# Altium project Scaffold.PrjPcb (part 2 of 2)

## Sheet Connectors.SchDoc
size A3; SheetNumber: 4; SheetTotal: 7
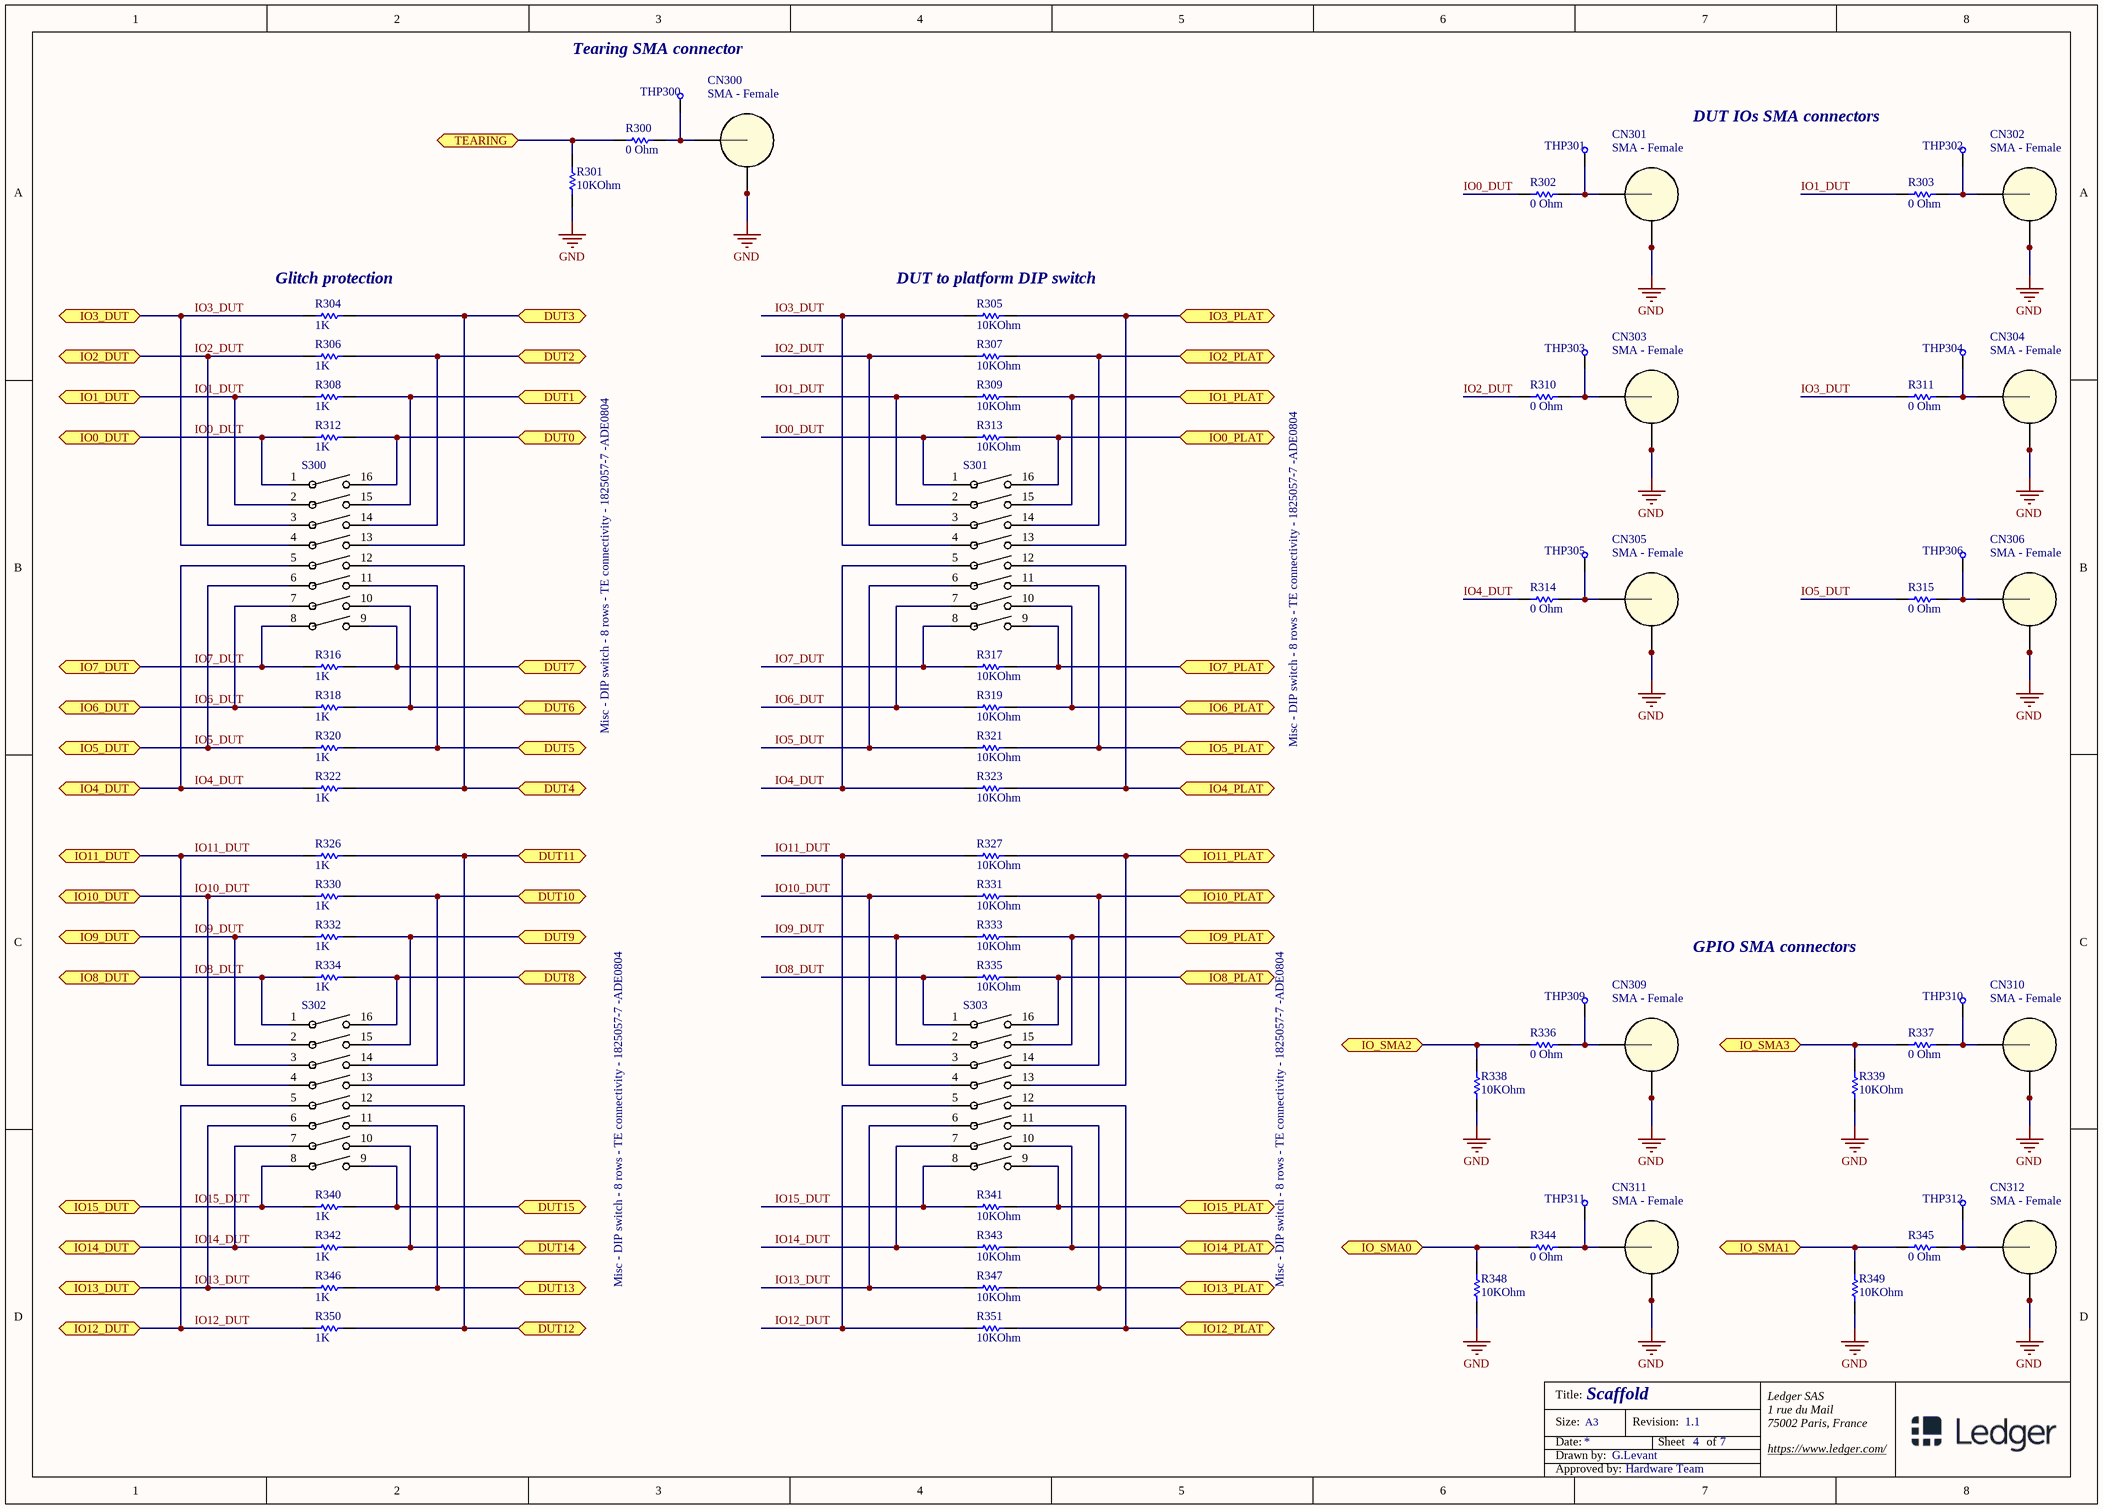
[diagram p5: Connectors.SchDoc]

### Parts
CN300  SMA - Female  [SAMTEC_SMA-J-P-X-ST-EM3]
CN301  SMA - Female  [SAMTEC_SMA-J-P-X-ST-EM3]
CN302  SMA - Female  [SAMTEC_SMA-J-P-X-ST-EM3]
CN303  SMA - Female  [SAMTEC_SMA-J-P-X-ST-EM3]
CN304  SMA - Female  [SAMTEC_SMA-J-P-X-ST-EM3]
CN305  SMA - Female  [SAMTEC_SMA-J-P-X-ST-EM3]
CN306  SMA - Female  [SAMTEC_SMA-J-P-X-ST-EM3]
CN309  SMA - Female  [SAMTEC_SMA-J-P-X-ST-EM3]
CN310  SMA - Female  [SAMTEC_SMA-J-P-X-ST-EM3]
CN311  SMA - Female  [SAMTEC_SMA-J-P-X-ST-EM3]
CN312  SMA - Female  [SAMTEC_SMA-J-P-X-ST-EM3]
R300  0 Ohm  [RES0603]
R301  10KOhm  [RES0603]
R302  0 Ohm  [RES0603]
R303  0 Ohm  [RES0603]
R304  1K  [RES0603]
R305  10KOhm  [RES0603]
R306  1K  [RES0603]
R307  10KOhm  [RES0603]
R308  1K  [RES0603]
R309  10KOhm  [RES0603]
R310  0 Ohm  [RES0603]
R311  0 Ohm  [RES0603]
R312  1K  [RES0603]
R313  10KOhm  [RES0603]
R314  0 Ohm  [RES0603]
R315  0 Ohm  [RES0603]
R316  1K  [RES0603]
R317  10KOhm  [RES0603]
R318  1K  [RES0603]
R319  10KOhm  [RES0603]
R320  1K  [RES0603]
R321  10KOhm  [RES0603]
R322  1K  [RES0603]
R323  10KOhm  [RES0603]
R326  1K  [RES0603]
R327  10KOhm  [RES0603]
R330  1K  [RES0603]
R331  10KOhm  [RES0603]
R332  1K  [RES0603]
R333  10KOhm  [RES0603]
R334  1K  [RES0603]
R335  10KOhm  [RES0603]
R336  0 Ohm  [RES0603]
R337  0 Ohm  [RES0603]
R338  10KOhm  [RES0603]
R339  10KOhm  [RES0603]
R340  1K  [RES0603]
R341  10KOhm  [RES0603]
R342  1K  [RES0603]
R343  10KOhm  [RES0603]
R344  0 Ohm  [RES0603]
R345  0 Ohm  [RES0603]
R346  1K  [RES0603]
R347  10KOhm  [RES0603]
R348  10KOhm  [RES0603]
R349  10KOhm  [RES0603]
R350  1K  [RES0603]
R351  10KOhm  [RES0603]
S300  Misc - DIP switch - 8 rows - TE connectivity - 1825057-7 -ADE0804  [SWDIP16_300X3.51]
S301  Misc - DIP switch - 8 rows - TE connectivity - 1825057-7 -ADE0804  [SWDIP16_300X3.51]
S302  Misc - DIP switch - 8 rows - TE connectivity - 1825057-7 -ADE0804  [SWDIP16_300X3.51]
S303  Misc - DIP switch - 8 rows - TE connectivity - 1825057-7 -ADE0804  [SWDIP16_300X3.51]
THP300  Misc - Test pin - Through hole - Millmax - 6821-0-00-15-00-00-08-0  [MILLMAX_6821-0-00-15-00-00-08-0]  (value not drawn)
THP301  Misc - Test pin - Through hole - Millmax - 6821-0-00-15-00-00-08-0  [MILLMAX_6821-0-00-15-00-00-08-0]  (value not drawn)
THP302  Misc - Test pin - Through hole - Millmax - 6821-0-00-15-00-00-08-0  [MILLMAX_6821-0-00-15-00-00-08-0]  (value not drawn)
THP303  Misc - Test pin - Through hole - Millmax - 6821-0-00-15-00-00-08-0  [MILLMAX_6821-0-00-15-00-00-08-0]  (value not drawn)
THP304  Misc - Test pin - Through hole - Millmax - 6821-0-00-15-00-00-08-0  [MILLMAX_6821-0-00-15-00-00-08-0]  (value not drawn)
THP305  Misc - Test pin - Through hole - Millmax - 6821-0-00-15-00-00-08-0  [MILLMAX_6821-0-00-15-00-00-08-0]  (value not drawn)
THP306  Misc - Test pin - Through hole - Millmax - 6821-0-00-15-00-00-08-0  [MILLMAX_6821-0-00-15-00-00-08-0]  (value not drawn)
THP309  Misc - Test pin - Through hole - Millmax - 6821-0-00-15-00-00-08-0  [MILLMAX_6821-0-00-15-00-00-08-0]  (value not drawn)
THP310  Misc - Test pin - Through hole - Millmax - 6821-0-00-15-00-00-08-0  [MILLMAX_6821-0-00-15-00-00-08-0]  (value not drawn)
THP311  Misc - Test pin - Through hole - Millmax - 6821-0-00-15-00-00-08-0  [MILLMAX_6821-0-00-15-00-00-08-0]  (value not drawn)
THP312  Misc - Test pin - Through hole - Millmax - 6821-0-00-15-00-00-08-0  [MILLMAX_6821-0-00-15-00-00-08-0]  (value not drawn)

### Ports
DUT0, DUT1, DUT2, DUT3, DUT4, DUT5, DUT6, DUT7, DUT8, DUT9, DUT10, DUT11, DUT12, DUT13, DUT14, DUT15, IO0_DUT, IO0_PLAT, IO1_DUT, IO1_PLAT, IO2_DUT, IO2_PLAT, IO3_DUT, IO3_PLAT, IO4_DUT, IO4_PLAT, IO5_DUT, IO5_PLAT, IO6_DUT, IO6_PLAT, IO7_DUT, IO7_PLAT, IO8_DUT, IO8_PLAT, IO9_DUT, IO9_PLAT, IO10_DUT, IO10_PLAT, IO11_DUT, IO11_PLAT, IO12_DUT, IO12_PLAT, IO13_DUT, IO13_PLAT, IO14_DUT, IO14_PLAT, IO15_DUT, IO15_PLAT, IO_SMA0, IO_SMA1, IO_SMA2, IO_SMA3, TEARING

### Nets
GND: CN300.2 CN300.3 CN301.2 CN301.3 CN302.2 CN302.3 CN303.2 CN303.3 CN304.2 CN304.3 CN305.2 CN305.3 CN306.2 CN306.3 CN309.2 CN309.3 CN310.2 CN310.3 CN311.2 CN311.3 CN312.2 CN312.3 R301.1 R338.1 R339.1 R348.1 R349.1
DUT_D0: R312.2 S300.16 ; port DUT0
DUT_D1: R308.2 S300.15 ; port DUT1
DUT_D2: R306.2 S300.14 ; port DUT2
IO0_DUT: R302.1 R312.1 R313.1 S300.1 S301.1 ; port IO0_DUT
IO1_DUT: R303.1 R308.1 R309.1 S300.2 S301.2 ; port IO1_DUT
IO2_DUT: R306.1 R307.1 R310.1 S300.3 S301.3 ; port IO2_DUT
IO3_DUT: R304.1 R305.1 R311.1 S300.4 S301.4 ; port IO3_DUT
IO4_DUT: R314.1 R322.1 R323.1 S300.5 S301.5 ; port IO4_DUT
IO5_DUT: R315.1 R320.1 R321.1 S300.6 S301.6 ; port IO5_DUT
IO6_DUT: R318.1 R319.1 S300.7 S301.7 ; port IO6_DUT
IO7_DUT: R316.1 R317.1 S300.8 S301.8 ; port IO7_DUT
IO8_DUT: R334.1 R335.1 S302.1 S303.1 ; port IO8_DUT
IO9_DUT: R332.1 R333.1 S302.2 S303.2 ; port IO9_DUT
IO10_DUT: R330.1 R331.1 S302.3 S303.3 ; port IO10_DUT
IO11_DUT: R326.1 R327.1 S302.4 S303.4 ; port IO11_DUT
IO12_DUT: R350.1 R351.1 S302.5 S303.5 ; port IO12_DUT
IO13_DUT: R346.1 R347.1 S302.6 S303.6 ; port IO13_DUT
IO14_DUT: R342.1 R343.1 S302.7 S303.7 ; port IO14_DUT
IO15_DUT: R340.1 R341.1 S302.8 S303.8 ; port IO15_DUT
NetCN300_1: CN300.1 R300.2 THP300.1
NetCN301_1: CN301.1 R302.2 THP301.1
NetCN302_1: CN302.1 R303.2 THP302.1
NetCN303_1: CN303.1 R310.2 THP303.1
NetCN304_1: CN304.1 R311.2 THP304.1
NetCN305_1: CN305.1 R314.2 THP305.1
NetCN306_1: CN306.1 R315.2 THP306.1
NetCN309_1: CN309.1 R336.2 THP309.1
NetCN310_1: CN310.1 R337.2 THP310.1
NetCN311_1: CN311.1 R344.2 THP311.1
NetCN312_1: CN312.1 R345.2 THP312.1
NetJ500_1: R309.2 S301.15 ; port IO1_PLAT
NetJ500_2: R313.2 S301.16 ; port IO0_PLAT
NetJ500_3: R305.2 S301.13 ; port IO3_PLAT
NetJ500_4: R307.2 S301.14 ; port IO2_PLAT
NetJ500_5: R321.2 S301.11 ; port IO5_PLAT
NetJ500_6: R323.2 S301.12 ; port IO4_PLAT
NetJ500_7: R317.2 S301.9 ; port IO7_PLAT
NetJ500_8: R319.2 S301.10 ; port IO6_PLAT
NetJ500_9: R333.2 S303.15 ; port IO9_PLAT
NetJ500_10: R335.2 S303.16 ; port IO8_PLAT
NetJ500_11: R327.2 S303.13 ; port IO11_PLAT
NetJ500_12: R331.2 S303.14 ; port IO10_PLAT
NetJ500_13: R347.2 S303.11 ; port IO13_PLAT
NetJ500_14: R351.2 S303.12 ; port IO12_PLAT
NetJ500_15: R341.2 S303.9 ; port IO15_PLAT
NetJ500_16: R343.2 S303.10 ; port IO14_PLAT
NetJ503_3: R304.2 S300.13 ; port DUT3
NetJ503_5: R320.2 S300.11 ; port DUT5
NetJ503_6: R322.2 S300.12 ; port DUT4
NetJ503_7: R316.2 S300.9 ; port DUT7
NetJ503_8: R318.2 S300.10 ; port DUT6
NetJ503_9: R332.2 S302.15 ; port DUT9
NetJ503_10: R334.2 S302.16 ; port DUT8
NetJ503_11: R326.2 S302.13 ; port DUT11
NetJ503_12: R330.2 S302.14 ; port DUT10
NetJ503_13: R346.2 S302.11 ; port DUT13
NetJ503_14: R350.2 S302.12 ; port DUT12
NetJ503_15: R340.2 S302.9 ; port DUT15
NetJ503_16: R342.2 S302.10 ; port DUT14
NetR300_1: R300.1 R301.2 ; port TEARING
NetR336_1: R336.1 R338.2 ; port IO_SMA2
NetR337_1: R337.1 R339.2 ; port IO_SMA3
NetR344_1: R344.1 R348.2 ; port IO_SMA0
NetR345_1: R345.1 R349.2 ; port IO_SMA1

### Notes on the sheet
- (near THP300) Tearing SMA connector
- DUT IOs SMA connectors
- (near R304) Glitch protection
- (near R305) DUT to platform DIP switch
- GPIO SMA connectors
- Title:
- Size:
- Date:
- Drawn by:
- A3
- Revision:
- Sheet
- of
- Ledger SAS
- 1 rue du Mail
- 75002 Paris, France
- https://www.ledger.com/
- Approved by:

### Library data of the parts
CN300-CN306 CN309-CN312 = Connector - SMA - Female - Horizontal - Mid Mount - Samtec - SMA–J–P–H–ST–EM3: pin to pad: 1>S1 2>G1 3>G2; Impedance: 50 Ohms; Manufacturer: Samtec; Manufacturer PN: SMA–J–P–H–ST–EM3; Type: SMA; Gender: Female
R300 R302 R303 R310 R311 R314 R315 R336 R337 R344 R345 = Resistor 0603 -        0Ohm - 1/10W - 1%: Resistor 0603 - 0Ohm - 1/10W - 1%; Manufacturer PN: CRCW06030000FKEA; Manufacturer: Vishay; PkgCode: 0603; Value: 0 Ohm; Power: 1/10W; Tolerance: 1%
R301 R305 R307 R309 R313 R317 R319 R321 R323 R327 R331 R333 R335 R338 R339 R341 R343 R347-R349 R351 = Resistor 0603 -    10KOhm - 1/10W - 1%: as R101 on sheet FPGA; Value: 10KOhm; Tolerance: 1%; Power: 1/10W; Manufacturer2: KOA Speer
R304 R306 R308 R312 R316 R318 R320 R322 R326 R330 R332 R334 R340 R342 R346 R350 = Resistor 0603 -      1KOhm - 1/10W - 1%: Resistor 0603 - 1KOhm - 1/10W - 1%; Manufacturer: Yageo; Manufacturer PN: RC0603FR-071KL; PkgCode: 0603; Value: 1K; Tolerance: 1%; Power: 1/10W
S300-S303 = Misc - DIP switch - 8 rows - TE connectivity - 1825057-7 -ADE0804: Misc - DIP switch - 8 rows - TE connectivity - 1825057-7; Nb rows: 8; Manufacturer: TE Connectivity; Manufacturer PN1: ADE0804; Manufacturer PN: 1825057-7
THP300-THP306 THP309-THP312 = Misc - Test pin - Through hole - Millmax - 6821-0-00-15-00-00-08-0: Manufacturer: Mill-max; Manufacturer PN: 6821-0-00-15-00-00-08-0

## Sheet RS232_Level_Shifters.SchDoc
size A4; SheetNumber: 7; SheetTotal: 7
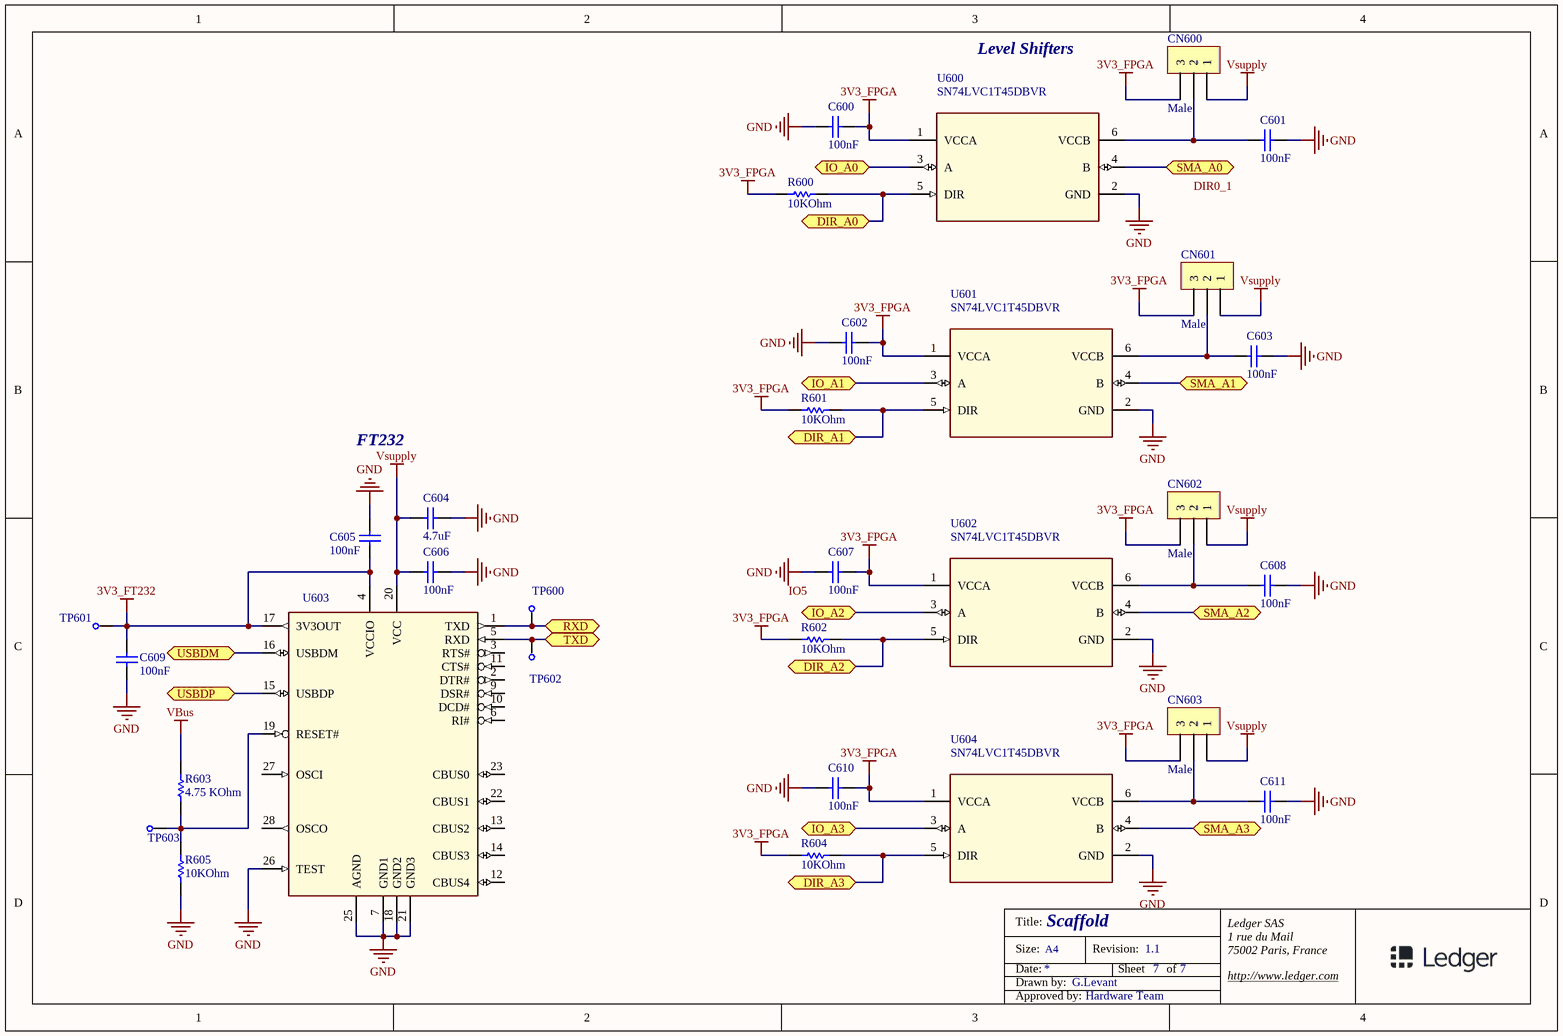
[diagram p6: RS232_Level_Shifters.SchDoc]

### Parts
C600  100nF  [CAP0603]
C601  100nF  [CAP0603]
C602  100nF  [CAP0603]
C603  100nF  [CAP0603]
C604  4.7uF  [CAP0603]
C605  100nF  [CAP0603]
C606  100nF  [CAP0603]
C607  100nF  [CAP0603]
C608  100nF  [CAP0603]
C609  100nF  [CAP0603]
C610  100nF  [CAP0603]
C611  100nF  [CAP0603]
CN600  Male  [MOLEX_90120-0123]
CN601  Male  [MOLEX_90120-0123]
CN602  Male  [MOLEX_90120-0123]
CN603  Male  [MOLEX_90120-0123]
R600  10KOhm  [RES0603]
R601  10KOhm  [RES0603]
R602  10KOhm  [RES0603]
R603  4.75 KOhm  [RES0603]
R604  10KOhm  [RES0603]
R605  10KOhm  [RES0603]
TP600  (no value)  [TP_001]  (no BOM)
TP601  (no value)  [TP_001]  (no BOM)
TP602  (no value)  [TP_001]  (no BOM)
TP603  (no value)  [TP_001]  (no BOM)
U600  SN74LVC1T45DBVR  [SOT95P280X145-6N]
U601  SN74LVC1T45DBVR  [SOT95P280X145-6N]
U602  SN74LVC1T45DBVR  [SOT95P280X145-6N]
U603  IC - USB-to-UART 1-CH 256Byte FIFO - 5V - 28-Pin SSOP  [SSOP28DB]  (value not drawn)
U604  SN74LVC1T45DBVR  [SOT95P280X145-6N]

### Ports
DIR_A0, DIR_A1, DIR_A2, DIR_A3, IO_A0, IO_A1, IO_A2, IO_A3, RXD, SMA_A0, SMA_A1, SMA_A2, SMA_A3, TXD, USBDM, USBDP

### Nets
3V3_FPGA: C600.2 C602.2 C607.2 C610.2 CN600.3 CN601.3 CN602.3 CN603.3 R600.2 R601.2 R602.2 R604.2 U600.1(VCCA) U601.1(VCCA) U602.1(VCCA) U604.1(VCCA)
3V3_FT232: C605.1 C609.1 TP601.1 U603.4(VCCIO) U603.17(3V3OUT)
GND: C600.1 C601.1 C602.1 C603.1 C604.2 C605.2 C606.2 C607.1 C608.1 C609.2 C610.1 C611.1 R605.1 U600.2(GND) U601.2(GND) U602.2(GND) U603.7(GND1) U603.18(GND2) U603.21(GND3) U603.25(AGND) U603.26(TEST) U604.2(GND)
VBus: R603.2
Vsupply: C604.1 C606.1 CN600.1 CN601.1 CN602.1 CN603.1 U603.20(VCC)
USBDM: U603.16(USBDM) ; port USBDM
USBDP: U603.15(USBDP) ; port USBDP
NetC601_2: C601.2 CN600.2 U600.6(VCCB)
NetC603_2: C603.2 CN601.2 U601.6(VCCB)
NetC608_2: C608.2 CN602.2 U602.6(VCCB)
NetC611_2: C611.2 CN603.2 U604.6(VCCB)
NetR336_1: U602.4(B) ; port SMA_A2
NetR337_1: U604.4(B) ; port SMA_A3
NetR344_1: U600.4(B) ; port SMA_A0
NetR345_1: U601.4(B) ; port SMA_A1
NetR600_1: R600.1 U600.5(DIR) ; port DIR_A0
NetR601_1: R601.1 U601.5(DIR) ; port DIR_A1
NetR602_1: R602.1 U602.5(DIR) ; port DIR_A2
NetR603_1: R603.1 R605.2 TP603.1 U603.19(RESET#)
NetR604_1: R604.1 U604.5(DIR) ; port DIR_A3
NetTP600_1: TP600.1 U603.1(TXD) ; port RXD
NetTP602_1: TP602.1 U603.5(RXD) ; port TXD
NetU100_30: U600.3(A) ; port IO_A0
NetU100_31: U601.3(A) ; port IO_A1
NetU100_32: U602.3(A) ; port IO_A2
NetU100_33: U604.3(A) ; port IO_A3

Not connected (* = marked no-connect by the designer): U603 2(DTR#) 3(RTS#) 6(RI#) 9(DSR#) 10(DCD#) 11(CTS#) 12(CBUS4) 13(CBUS2) 14(CBUS3) 22(CBUS1) 23(CBUS0) 27(OSCI) 28(OSCO)

### Notes on the sheet
- Level Shifters
- FT232
- Labels drawn without touching a wire or pin: DIR0_1, IO5
- Title:
- Size:
- Date:
- Drawn by:
- A4
- Revision:
- Sheet
- of
- Ledger SAS
- 1 rue du Mail
- 75002 Paris, France
- http://www.ledger.com
- Approved by:

### Library data of the parts
C600-C603 C605 C607-C611 = Capacitor 0603 - 100nF - 16V - X7R - 10%: Manufacturer2 PN: MCCA000159; Manufacturer1: Yageo; Manufacturer1 PN: CC0603KRX7R7BB104; Manufacturer: Wurth; Manufacturer PN: 885012206046; PkgCode: 0603; Manufacturer2: Multicomp; Value: 100nF; Power: 16V; Tolerance: 10%; Type: X7R
C604 = Capacitor 0603 -  4.7uF - 16V - X5R - 10%: Capacitor 0603 - 4.7uF - 16V - X5R - 10%; Manufacturer: Murata; Manufacturer PN: GRM188R61C475KE11; Manufacturer1: TDK; Manufacturer1 PN: C1608X5R1C475K080AC; PkgCode: 0603; value: 4.7uF; Type: X5R; Tolerance: 10%; Power: 16V
C606 = Capacitor 0603 - 100nF - 16V - X7R - 10%: Manufacturer: Wurth; Manufacturer PN: 885012206046; Manufacturer2 PN: MCCA000159; Manufacturer1: Yageo; Manufacturer1 PN: CC0603KRX7R7BB104; PkgCode: 0603; Value: 100nF; Power: 16V; Tolerance: 10%; Type: X7R; Manufacturer2: Multicomp
CN600-CN603 = Connector - Header - 3-Pin - single row - Male - Molex_90120-0123: Manufacturer: Molex; NoPins: 3; NoRows: 1; Pitch: 2.54; Manufacturer PN: 90120-0123; Type: Male
R600-R602 R604 R605 = Resistor 0603 -    10KOhm - 1/10W - 1%: Manufacturer: Yageo; Manufacturer PN: RC0603FR-0710KL; Manufacturer1: Panasonic; Manufacturer1 PN: ERJ3EKF1002; Manufacturer2 PN: RK73H1JHT..1002F; PkgCode: 0603; Value: 10KOhm; Tolerance: 1%; Power: 1/10W; Manufacturer2: KOA Speer
R603 = Resistor 0603 - 4.75KOhm - 1/10W - 1%: Manufacturer PN: CRCW06034K75FKEA; Manufacturer: Vishay; PkgCode: 0603; Value: 4.75 KOhm; Power: 1/10W; Tolerance: 1%
TP600-TP603 = Misc - Test point CMS
U600-U602 U604 = Logic - Level Shifter - 1.65V - 5.5V - 420Mbps -3-state - SOT23-6 - Texas Instruments - SN74LVC1T45DBVR: Manufacturer PN: SN74LVC1T45DBVR; Manufacturer: Texas Instruments; Application_BuildNumber: *
U603 = IC - USB-to-UART 1-CH 256Byte FIFO - 5V - 28-Pin SSOP: Manufacturer: FTDI; Manufacturer PN: FT232RL

## Nets that join several sheets
1V2_FPGA: Power (C214.2 TP209.1 U206.5), FPGA (29 pins)
2V5_FPGA: Power (C216.2 TP210.1 U207.5), FPGA (5 pins)
3V3_FPGA: Power (C220.2 TP211.1 U208.5), FPGA (28 pins), RS232_Level_Shifters (16 pins)
3V3_LED_DRIVER: Power (C212.2 TP208.1 U204.5), LEDs (C400.1 C401.1 U400.31)
GND: Power (65 pins), LEDs (5 pins), FPGA (77 pins), DUT_Platform (7 pins), Connectors (27 pins), RS232_Level_Shifters (22 pins)
VBus: Power (CN203.3 F201.1), RS232_Level_Shifters (R603.2)
VCC_DUT: Power (6 pins), DUT_Platform (J503.20)
VCC_DUT_PERMANENT: Power (C210.2 CN206.2 Q203.2 R209.2), DUT_Platform (J503.18)
VCC_IO_FPGA: Power (C218.2 R216.1 THP203.1 U205.4), FPGA (13 pins)
VCC_PLATFORM: Power (6 pins), DUT_Platform (J500.20)
VCC_PLATFORM_PERMANENT: Power (C202.2 CN201.2 Q200.2 R201.2), DUT_Platform (J500.18)
Vsupply: Power (27 pins), LEDs (24 pins), RS232_Level_Shifters (7 pins)
DUT_D0: FPGA (R110.2), DUT_Platform (J503.2), Connectors (R312.2 S300.16)
DUT_D1: FPGA (R111.2), DUT_Platform (J503.1), Connectors (R308.2 S300.15)
DUT_D2: FPGA (R112.1), DUT_Platform (J503.4), Connectors (R306.2 S300.14)
IO0_DUT: FPGA (U100.58), Connectors (5 pins)
IO1_DUT: FPGA (U100.60), Connectors (5 pins)
IO2_DUT: FPGA (U100.65), Connectors (5 pins)
IO3_DUT: FPGA (U100.67), Connectors (5 pins)
IO4_DUT: FPGA (U100.76), Connectors (5 pins)
IO5_DUT: FPGA (U100.80), Connectors (5 pins)
IO6_DUT: FPGA (U100.85), Connectors (R318.1 R319.1 S300.7 S301.7)
IO7_DUT: FPGA (U100.98), Connectors (R316.1 R317.1 S300.8 S301.8)
IO8_DUT: FPGA (U100.100), Connectors (R334.1 R335.1 S302.1 S303.1)
IO9_DUT: FPGA (U100.103), Connectors (R332.1 R333.1 S302.2 S303.2)
IO10_DUT: FPGA (U100.105), Connectors (R330.1 R331.1 S302.3 S303.3)
IO11_DUT: FPGA (U100.110), Connectors (R326.1 R327.1 S302.4 S303.4)
IO12_DUT: FPGA (U100.112), Connectors (R350.1 R351.1 S302.5 S303.5)
IO13_DUT: FPGA (U100.114), Connectors (R346.1 R347.1 S302.6 S303.6)
IO14_DUT: FPGA (U100.119), Connectors (R342.1 R343.1 S302.7 S303.7)
IO15_DUT: FPGA (U100.121), Connectors (R340.1 R341.1 S302.8 S303.8)
LED_/OE: LEDs (TP402.1 U400.29), FPGA (U100.51)
LED_CLK: LEDs (TP400.1 U400.3), FPGA (U100.46)
LED_LE: LEDs (TP401.1 U400.4), FPGA (U100.44)
NetCN207_1: Power (CN207.1 R210.1 THP201.1 U203.3), DUT_Platform (J503.19)
NetJ500_1: FPGA (U100.64), DUT_Platform (J500.1), Connectors (R309.2 S301.15)
NetJ500_2: FPGA (U100.59), DUT_Platform (J500.2), Connectors (R313.2 S301.16)
NetJ500_3: FPGA (U100.68), DUT_Platform (J500.3), Connectors (R305.2 S301.13)
NetJ500_4: FPGA (U100.66), DUT_Platform (J500.4), Connectors (R307.2 S301.14)
NetJ500_5: FPGA (U100.83), DUT_Platform (J500.5), Connectors (R321.2 S301.11)
NetJ500_6: FPGA (U100.77), DUT_Platform (J500.6), Connectors (R323.2 S301.12)
NetJ500_7: FPGA (U100.99), DUT_Platform (J500.7), Connectors (R317.2 S301.9)
NetJ500_8: FPGA (U100.86), DUT_Platform (J500.8), Connectors (R319.2 S301.10)
NetJ500_9: FPGA (U100.104), DUT_Platform (J500.9), Connectors (R333.2 S303.15)
NetJ500_10: FPGA (U100.101), DUT_Platform (J500.10), Connectors (R335.2 S303.16)
NetJ500_11: FPGA (U100.111), DUT_Platform (J500.11), Connectors (R327.2 S303.13)
NetJ500_12: FPGA (U100.106), DUT_Platform (J500.12), Connectors (R331.2 S303.14)
NetJ500_13: FPGA (U100.115), DUT_Platform (J500.13), Connectors (R347.2 S303.11)
NetJ500_14: FPGA (U100.113), DUT_Platform (J500.14), Connectors (R351.2 S303.12)
NetJ500_15: FPGA (U100.120), DUT_Platform (J500.15), Connectors (R341.2 S303.9)
NetJ500_16: FPGA (U100.125), DUT_Platform (J500.16), Connectors (R343.2 S303.10)
NetJ503_3: DUT_Platform (J503.3), Connectors (R304.2 S300.13)
NetJ503_5: DUT_Platform (J503.5), Connectors (R320.2 S300.11)
NetJ503_6: DUT_Platform (J503.6), Connectors (R322.2 S300.12)
NetJ503_7: DUT_Platform (J503.7), Connectors (R316.2 S300.9)
NetJ503_8: DUT_Platform (J503.8), Connectors (R318.2 S300.10)
NetJ503_9: DUT_Platform (J503.9), Connectors (R332.2 S302.15)
NetJ503_10: DUT_Platform (J503.10), Connectors (R334.2 S302.16)
NetJ503_11: DUT_Platform (J503.11), Connectors (R326.2 S302.13)
NetJ503_12: DUT_Platform (J503.12), Connectors (R330.2 S302.14)
NetJ503_13: DUT_Platform (J503.13), Connectors (R346.2 S302.11)
NetJ503_14: DUT_Platform (J503.14), Connectors (R350.2 S302.12)
NetJ503_15: DUT_Platform (J503.15), Connectors (R340.2 S302.9)
NetJ503_16: DUT_Platform (J503.16), Connectors (R342.2 S302.10)
NetQ202_3: Power (Q202.3 R205.2 TP203.1), FPGA (U100.132)
NetQ205_3: Power (Q205.3 R215.2 TP207.1), FPGA (U100.133)
NetR300_1: FPGA (U100.28), Connectors (R300.1 R301.2)
NetR336_1: Connectors (R336.1 R338.2), RS232_Level_Shifters (U602.4)
NetR337_1: Connectors (R337.1 R339.2), RS232_Level_Shifters (U604.4)
NetR344_1: Connectors (R344.1 R348.2), RS232_Level_Shifters (U600.4)
NetR345_1: Connectors (R345.1 R349.2), RS232_Level_Shifters (U601.4)
NetR600_1: FPGA (U100.11), RS232_Level_Shifters (R600.1 U600.5)
NetR601_1: FPGA (U100.10), RS232_Level_Shifters (R601.1 U601.5)
NetR602_1: FPGA (U100.7), RS232_Level_Shifters (R602.1 U602.5)
NetR604_1: FPGA (U100.39), RS232_Level_Shifters (R604.1 U604.5)
NetTP403_1: LEDs (TP403.1 U400.2), FPGA (U100.49)
NetTP405_1: LEDs (TP405.1 U400.30), FPGA (U100.50)
NetTP600_1: FPGA (U100.144), RS232_Level_Shifters (TP600.1 U603.1)
NetTP602_1: FPGA (U100.143), RS232_Level_Shifters (TP602.1 U603.5)
NetU100_30: FPGA (U100.30), RS232_Level_Shifters (U600.3)
NetU100_31: FPGA (U100.31), RS232_Level_Shifters (U601.3)
NetU100_32: FPGA (U100.32), RS232_Level_Shifters (U602.3)
NetU100_33: FPGA (U100.33), RS232_Level_Shifters (U604.3)
USBDM: Power (D203.C J200.2), RS232_Level_Shifters (U603.16)
USBDP: Power (D204.C J200.3), RS232_Level_Shifters (U603.15)

## Assembly variants
Resistors DUT to platform not mounted: not fitted R305 R307 R309 R313 R317 R319 R321 R323 R327 R331 R333 R335 R341 R343 R347 R351